# Altium schematic sheet Pressure_Transducers_SCH.SchDoc
size B
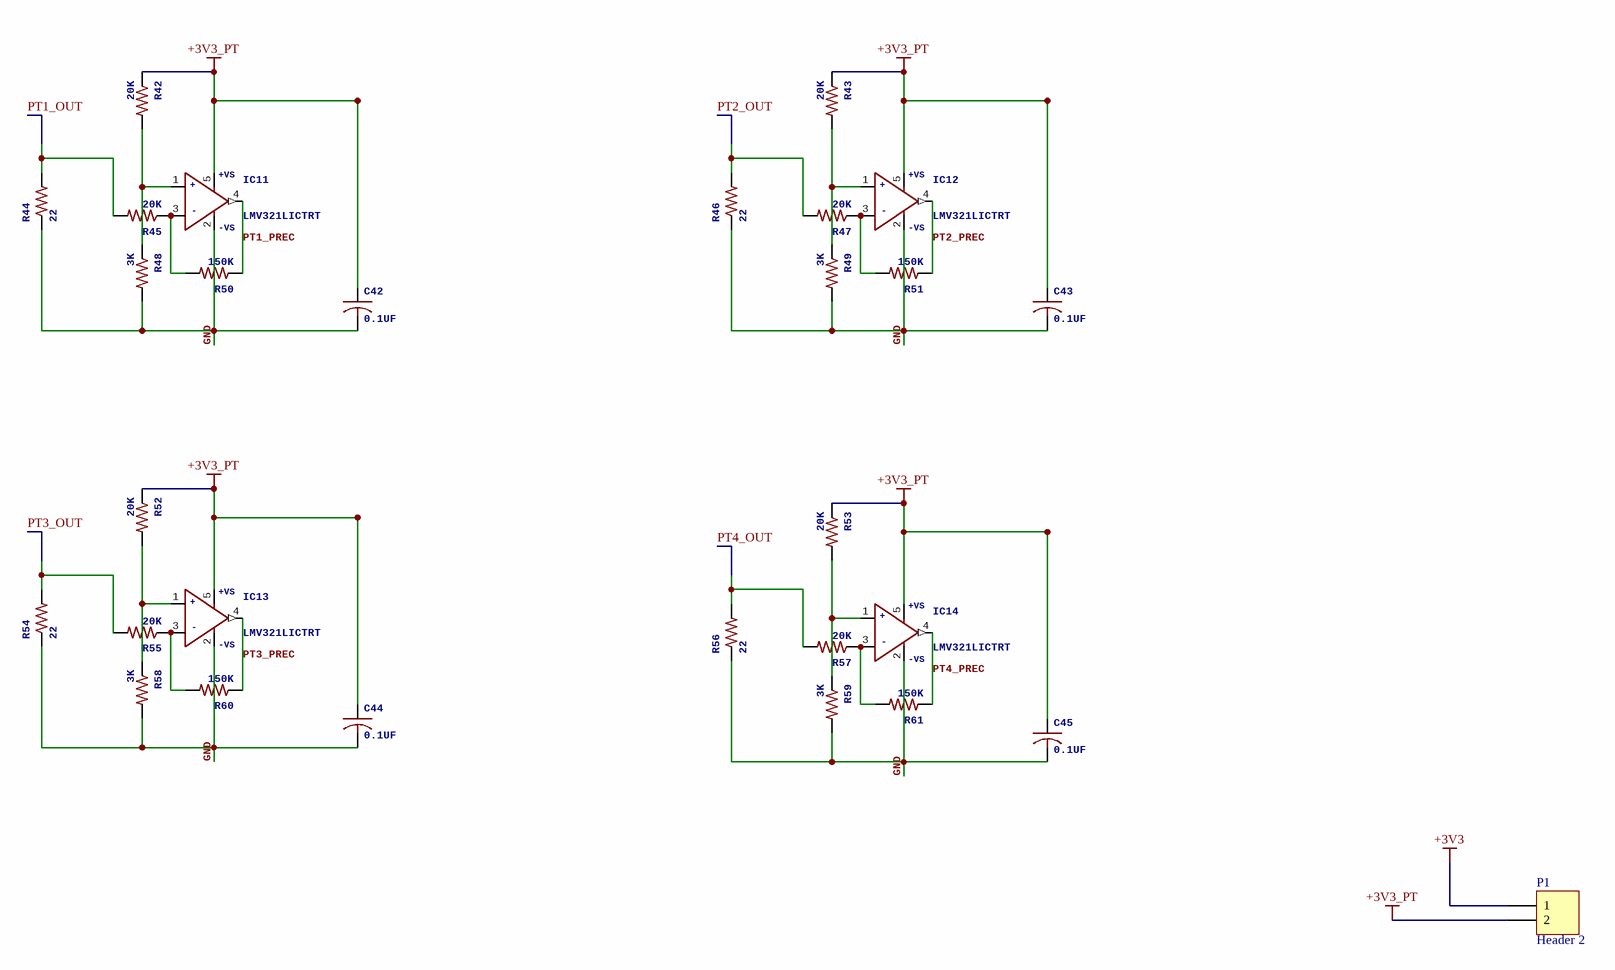
[diagram p0: Pressure_Transducers_SCH.SchDoc]

## Parts
C42  0.1UF  [CAPCP2012X06N]
C43  0.1UF  [CAPCP2012X06N]
C44  0.1UF  [CAPCP2012X06N]
C45  0.1UF  [CAPCP2012X06N]
IC11  LMV321LICTRT  [SOT95P245X110-5N]
IC12  LMV321LICTRT  [SOT95P245X110-5N]
IC13  LMV321LICTRT  [SOT95P245X110-5N]
IC14  LMV321LICTRT  [SOT95P245X110-5N]
P1  Header 2  [HDR1X2]
R42  20K  [RESC_0805_2012]
R43  20K  [RESC_0805_2012]
R44  22  [RESC_0805_2012]
R45  20K  [RESC_0805_2012]
R46  22  [RESC_0805_2012]
R47  20K  [RESC_0805_2012]
R48  3K  [RESC_0805_2012]
R49  3K  [RESC_0805_2012]
R50  150K  [RESC_0805_2012]
R51  150K  [RESC_0805_2012]
R52  20K  [RESC_0805_2012]
R53  20K  [RESC_0805_2012]
R54  22  [RESC_0805_2012]
R55  20K  [RESC_0805_2012]
R56  22  [RESC_0805_2012]
R57  20K  [RESC_0805_2012]
R58  3K  [RESC_0805_2012]
R59  3K  [RESC_0805_2012]
R60  150K  [RESC_0805_2012]
R61  150K  [RESC_0805_2012]

## Nets
+3V3: P1.1
+3V3_PT: C42.1 C43.1 C44.1 C45.1 IC11.5(+VS) IC12.5(+VS) IC13.5(+VS) IC14.5(+VS) P1.2 R42.1 R43.1 R52.1 R53.1
GND: C42.2 C43.2 C44.2 C45.2 IC11.2(-VS) IC12.2(-VS) IC13.2(-VS) IC14.2(-VS) R44.1 R46.1 R48.2 R49.2 R54.1 R56.1 R58.2 R59.2
PT1_OUT: R44.2 R45.2
PT1_PREC: IC11.4(OUT) R50.1
PT2_OUT: R46.2 R47.2
PT2_PREC: IC12.4(OUT) R51.1
PT3_OUT: R54.2 R55.2
PT3_PREC: IC13.4(OUT) R60.1
PT4_OUT: R56.2 R57.2
PT4_PREC: IC14.4(OUT) R61.1
NetIC11_1: IC11.1(IN+) R42.2 R48.1
NetIC11_3: IC11.3(IN-) R45.1 R50.2
NetIC12_1: IC12.1(IN+) R43.2 R49.1
NetIC12_3: IC12.3(IN-) R47.1 R51.2
NetIC13_1: IC13.1(IN+) R52.2 R58.1
NetIC13_3: IC13.3(IN-) R55.1 R60.2
NetIC14_1: IC14.1(IN+) R53.2 R59.1
NetIC14_3: IC14.3(IN-) R57.1 R61.2

## Library data of the parts
C42-C45 = C-USC0805: CAPACITOR, American symbol; GateName_1: G$1; SymbolName_1: C-US; DeviceName: C0805; LibraryName: rcl; DeviceSetName: C-US; SPICEPREFIX: C
IC11-IC14 = LMV321LICTRT: High Performance, 145 MHz FastFET Op AmpsSource: http://www.analog.com/static/imported-files/data_sheets/AD8065_8066.pdf; MPN: AD8065ARTZ-REEL7; GateName_1: G$; SymbolName_1: OP+-VS; DeviceName: RT; MF: ALTERA CORPORATION; LibraryName: st-microelectronics-extra; DeviceSetName: LMV321LICT; OC_FARNELL: 1464845; OC_NEWARK: 59K6316; +: +; -: -; +VS: +VS; -VS: -VS
P1 = Header 2: Header, 2-Pin; LatestRevisionDate: 17-Jul-2002; LatestRevisionNote: Re-released for DXP Platform.; Publisher: Altium Limited
R42-R61 = R-US_R0805: RESISTOR, American symbol; GateName_1: G$1; SymbolName_1: R-US; DeviceName: R0805; DeviceSetName: R-US_; LibraryName: rcl